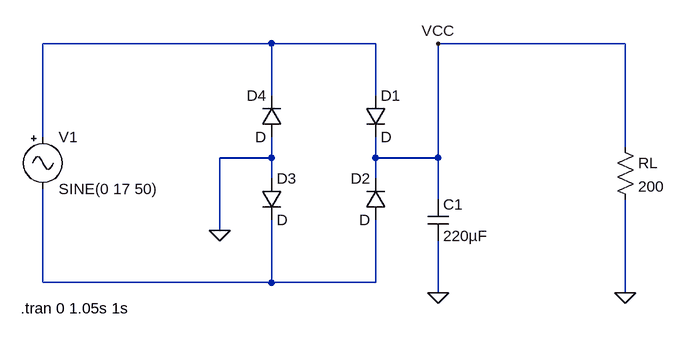
[diagram p0: schematic psu-aux.asc]
psu-aux.asc, the LTspice schematic file:
Version 4
SHEET 1 960 680
WIRE 336 48 -16 48
WIRE 496 48 336 48
WIRE 880 48 592 48
WIRE 336 128 336 48
WIRE 496 128 496 48
WIRE -16 192 -16 48
WIRE 880 208 880 48
WIRE 336 224 336 192
WIRE 336 224 256 224
WIRE 496 224 496 192
WIRE 592 224 592 48
WIRE 592 224 496 224
WIRE 336 256 336 224
WIRE 496 256 496 224
WIRE 592 288 592 224
WIRE 256 336 256 224
WIRE -16 416 -16 272
WIRE 336 416 336 320
WIRE 336 416 -16 416
WIRE 496 416 496 320
WIRE 496 416 336 416
WIRE 592 432 592 352
WIRE 880 432 880 288
FLAG 256 336 0
FLAG 592 48 VCC
FLAG 880 432 0
FLAG 592 432 0
SYMBOL Misc\\signal -16 176 R0
WINDOW 123 0 0 Left 0
WINDOW 39 0 0 Left 0
SYMATTR InstName V1
SYMATTR Value SINE(0 17 50)
SYMBOL diode 480 128 R0
SYMATTR InstName D1
SYMBOL diode 512 320 R180
WINDOW 0 24 64 Left 2
WINDOW 3 24 0 Left 2
SYMATTR InstName D2
SYMBOL diode 320 256 R0
SYMATTR InstName D3
SYMBOL diode 352 192 R180
WINDOW 0 24 64 Left 2
WINDOW 3 24 0 Left 2
SYMATTR InstName D4
SYMBOL cap 576 288 R0
SYMATTR InstName C1
SYMATTR Value 220µF
SYMATTR SpiceLine V=35
SYMBOL res 864 192 R0
SYMATTR InstName RL
SYMATTR Value 200
TEXT -50 456 Left 2 !.tran 0 1.05s 1s

The netlist it stands for:
* psu-aux.asc
V1 N001 N002 SINE(0 17 50)
D1 N001 VCC D
D2 N002 VCC D
D3 0 N002 D
D4 0 N001 D
C1 VCC 0 220µF V=35
RL VCC 0 200
.model D D
.lib standard.dio
.tran 0 1.05s 1s
.backanno
.end